# Altium schematic sheet USB_HS.SchDoc
size A4
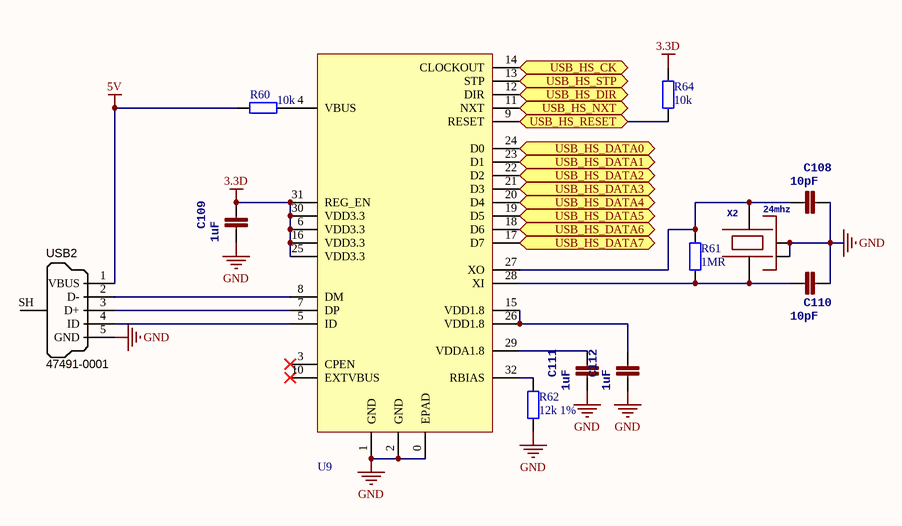
[diagram p0: USB_HS.SchDoc]

## Parts
C108  10pF  [0402]
C109  1uF  [0402]
C110  10pF  [0402]
C111  1uF  [0402]
C112  1uF  [0402]
R60  10k  [0402]
R61  1MR  [0402]
R62  12k 1%  [0402]
R64  10k  [0402]
U9  USB3300_1  [USB3300]  (value not drawn)
USB2  Manufacturer Part Number 1: 47491-0001  [MICRO-YZX]  (hidden comment: USB Micro Type B)
X2  24mhz  [OSCILLATOR-3.2X2.5]

## Ports
USB_HS_CK, USB_HS_DATA0, USB_HS_DATA1, USB_HS_DATA2, USB_HS_DATA3, USB_HS_DATA4, USB_HS_DATA5, USB_HS_DATA6, USB_HS_DATA7, USB_HS_DIR, USB_HS_NXT, USB_HS_RESET, USB_HS_STP

## Nets
3.3D: C109.1 R64.2 U9.6(VDD3.3) U9.16(VDD3.3) U9.25(VDD3.3) U9.30(VDD3.3) U9.31(REG_EN)
5V: R60.1 USB2.1(VBUS)
GND: C108.1 C109.2 C110.1 C111.2 C112.2 R62.1 U9.0(EPAD) U9.1(GND) U9.2(GND) USB2.5(GND) X2.2(NC_2) X2.4(NC_4)
USB_HS_CK: U9.14(CLOCKOUT) ; port USB_HS_CK
USB_HS_DATA0: U9.24(D0) ; port USB_HS_DATA0
USB_HS_DATA1: U9.23(D1) ; port USB_HS_DATA1
USB_HS_DATA2: U9.22(D2) ; port USB_HS_DATA2
USB_HS_DATA3: U9.21(D3) ; port USB_HS_DATA3
USB_HS_DATA4: U9.20(D4) ; port USB_HS_DATA4
USB_HS_DATA5: U9.19(D5) ; port USB_HS_DATA5
USB_HS_DATA6: U9.18(D6) ; port USB_HS_DATA6
USB_HS_DATA7: U9.17(D7) ; port USB_HS_DATA7
USB_HS_DIR: U9.12(DIR) ; port USB_HS_DIR
USB_HS_NXT: U9.11(NXT) ; port USB_HS_NXT
USB_HS_RESET: R64.1 U9.9(RESET) ; port USB_HS_RESET
USB_HS_STP: U9.13(STP) ; port USB_HS_STP
NetC108_2: C108.2 R61.2 U9.27(XO) X2.3
NetC110_2: C110.2 R61.1 U9.28(XI) X2.1
NetC111_1: C111.1 U9.29(VDDA1.8)
NetC112_1: C112.1 U9.15(VDD1.8) U9.26(VDD1.8)
NetR60_2: R60.2 U9.4(VBUS)
NetR62_2: R62.2 U9.32(RBIAS)
NetU9_5: U9.5(ID) USB2.4(ID)
NetU9_7: U9.7(DP) USB2.3(D+)
NetU9_8: U9.8(DM) USB2.2(D-)

Not connected (* = marked no-connect by the designer): U9 3(CPEN)* 10(EXTVBUS)*; USB2 SH(Shell)

## Library data of the parts
C108-C112 = CAP0402-CAP: <b>Capacitor</b> / Standard 0603 ceramic capacitor, and 0.1" leaded capacitor.; PARTNO: CC0402ZRY5V7BB104
R60-R62 R64 = Res2: Resistor; Value: 0Ohm; Published: 8-Jun-2000; LatestRevisionDate: 17-Jul-2002; LatestRevisionNote: Re-released for DXP Platform.; PackageReference: AXIAL-0.4; Publisher: Altium Limited; PackageDescription: Axial Device, Thru-Hole; 2 Leads; 0.4 in Pin Spacing
USB2 = USB_Micro_TypeB: Connector SMD USB Micro Type B middle mount; Manufacturer 1: Molex Inc; SCDType: undef; Package / Case: SMD; Supplier 1: Digi-Key; Supplier Part Number 1: WM17142CT-ND
X2 = OSCILLATOR-3.2X2.5: Crystal Oscillator in 3.2x2.5 SMD